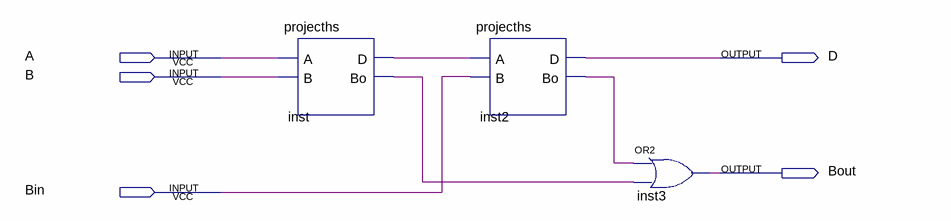
[diagram p0: schematic sheet]
// Quartus schematic projectfs2.bdf as structural Verilog: 3 symbols, 5 pins
module projectfs2 (
  input  A,
  input  B,
  input  Bin,
  output D,
  output Bout
);

  wire inst2_bo, inst_bo, inst_d;

  projecths inst (.A(A), .B(B), .D(inst_d), .Bo(inst_bo));
  projecths inst2 (.A(inst_d), .B(Bin), .D(D), .Bo(inst2_bo));
  or inst3 (Bout, inst2_bo, inst_bo);
endmodule
